# Altium schematic sheet Sonar_Gonderici_Sheet1.SchDoc
size A3; SheetNumber: 1; SheetTotal: 1
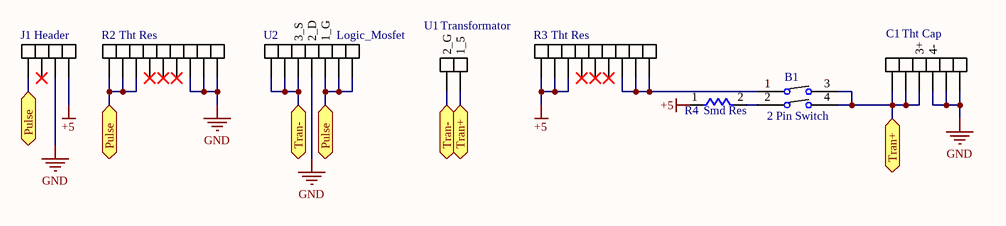
[diagram p0: Sonar_Gonderici_Sheet1.SchDoc]

## Parts
B1  2 Pin Switch  [2 Pin Switch]
C1  Tht Cap  [THT CAP POL]
J1  Header  [Header]
R2  Tht Res  [THT Res]
R3  Tht Res  [THT Res]
R4  Smd Res  [RESC1005X40]
U1  Transformator  [Transfornator]
U2  Logic_Mosfet  [Logic_Mosfet]

## Ports
Pulse (bidir), Tran+ (bidir), Tran- (bidir)

## Nets
+5: J1.4 R3.7 R3.8 R3.9 R4.1
GND: C1.4(4-) C1.5 C1.6 J1.3 R2.1 R2.2 R2.3 U2.4(2_D)
Pulse: J1.1 R2.7 R2.8 R2.9 U2.1 U2.2 U2.3(1_G) ; port Pulse
Tran+: B1.3 B1.4 C1.1 C1.2 C1.3(3+) U1.1(1_5) ; port Tran+
Tran-: U1.2(2_G) U2.5(3_S) U2.6 U2.7 ; port Tran-
NetB1_1: B1.1 R3.1 R3.2 R3.3
NetB1_2: B1.2 R4.2

Not connected (* = marked no-connect by the designer): R2 4* 5* 6*; R3 4* 5* 6*

## Library data of the parts
B1 = 2 Pin Switch: ComponentLink1Description: Satın Alma Linki; ComponentLink1URL: https://www.direnc.net/2-pin-dip-switch
C1 = Tht Cap: ComponentLink10Description: Satın Alma Linki; ComponentLink10URL: https://www.direnc.net/47uf16v; ComponentLink11Description: Satın Alma Linki; ComponentLink11URL: https://www.direnc.net/2-pin-508mm-90-gecmeli-takim-klemens; ComponentLink12Description: Satın Alma Linki; ComponentLink12URL: https://www.direnc.net/2-pin-508mm-90-erkek-gecmeli-yesil-klemens-1
J1 = Header: ComponentLink1Description: Satın Alma Linki; ComponentLink1URL: https://www.direnc.net/1x40-precision-disi-header; ComponentLink2Description: Datasheet; ComponentLink2URL: https://www.signal.com.tr/pdf/cat/PH1S15_17_25-2XX-L_U.pdf
R2 R3 = Tht Res: ComponentLink10Description: Satın Alma Linki; ComponentLink10URL: https://www.robolinkmarket.com/1-4w-4r7-direnc-paketi-10-adet?_sgm_campaign=fcs_9ec70268bc000&_sgm_source=5399%7Cproduct&_sgm_action=search&_sgm_term=diren%C3%A7; ComponentLink11Description: Satın Alma Linki; ComponentLink11URL: https://www.direnc.net/2-pin-508mm-90-erkek-gecmeli-yesil-klemens-1; ComponentLink12Description: Satın Alma Linki; ComponentLink12URL: https://www.direnc.net/2-pin-508mm-90-gecmeli-takim-klemens
R4 = Smd Res: ComponentLink10Description: Satın Alma Linki; ComponentLink10URL: https://www.direnc.net/47k-5-1w-2512-smd-direnc; ComponentLink11Description: Datasheet; ComponentLink11URL: https://www.resistor.com/assets/pdf/2512std.pdf
U1 = Transformator: ComponentLink1Description: Satın Alma Linki; ComponentLink1URL: https://www.direnc.net/2-pin-508mm-90-erkek-gecmeli-yesil-klemens-1; ComponentLink3Description: Satın Alma Linki; ComponentLink3URL: https://www.direnc.net/2-pin-508mm-90-gecmeli-takim-klemens
U2 = Logic_Mosfet: ComponentLink1Description: Satın Alma Linki; ComponentLink1URL: https://www.robotistan.com/buz101l-29a-50v-mosfet-logl-logic-level-to220?language=tr&h=3cb70a68; ComponentLink2Description: Satın Alma Linki; ComponentLink2URL: https://www.robolinkmarket.com/buz101l-29a-50v-mosfet-logl-logic-level-to220-mosfet; ComponentLink3Description: Datasheet; ComponentLink3URL: https://www.robolinkmarket.com/Data/EditorFiles/PDF/buz101l.pdf; ComponentLink4Description: Satın Alma Linki; ComponentLink4URL: https://www.direnc.net/3-pin-508mm-disi-gecmeli-klemens-11943; ComponentLink5Description: Satın Alma Linki; ComponentLink5URL: https://www.direnc.net/3-pin-508mm-90-gecmeli-takim-klemens; ComponentLink6Description: Satın Alma Linki; ComponentLink6URL: https://www.direnc.net/irlz44n-d2pak-smd-n-kanal-mosfet; ComponentLink7Description: Datasheet; ComponentLink7URL: https://pdf.direnc.net/upload/irlz44nslpbf-datasheet.pdf